# EAGLE design IMU_breakout (EAGLE 7.3.0)
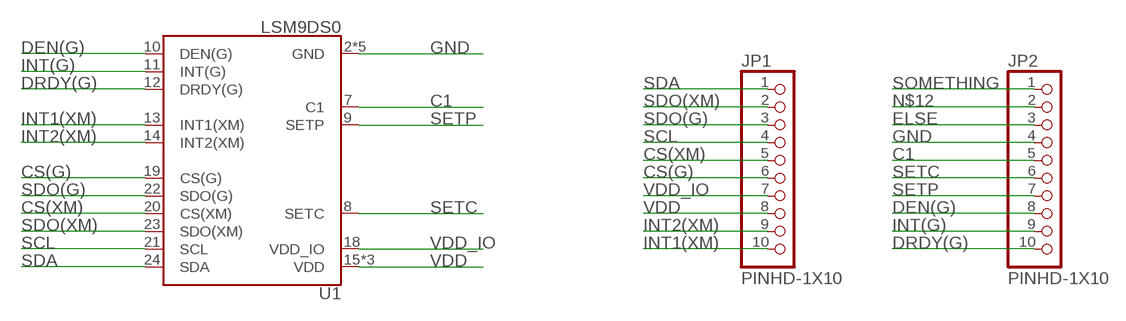
[diagram p0: schematic, sheet 1]

## Parts
JP1  PINHD-1X10  [1X10-BIG]
JP2  PINHD-1X10  [1X10-BIG]
U1  LSM9DS0  [LGA-24]

## Nets
C1: JP2.5 U1.7(C1)
CS(G): JP1.6 U1.19(CS(G))
CS(XM): JP1.5 U1.20(CS(XM))
DEN(G): JP2.8 U1.10(DEN(G))
DRDY(G): JP2.10 U1.12(DRDY(G))
ELSE: JP2.3
GND: JP2.4 U1.2(GND) U1.3(GND) U1.4(GND) U1.5(GND) U1.6(GND)
INT1(XM): JP1.10 U1.13(INT1(XM))
INT2(XM): JP1.9 U1.14(INT2(XM))
INT(G): JP2.9 U1.11(INT(G))
N$12: JP2.2
SCL: JP1.4 U1.21(SCL)
SDA: JP1.1 U1.24(SDA)
SDO(G): JP1.3 U1.22(SDO(G))
SDO(XM): JP1.2 U1.23(SDO(XM))
SETC: JP2.6 U1.8(SETC)
SETP: JP2.7 U1.9(SETP)
SOMETHING: JP2.1
VDD: JP1.8 U1.15(VDD) U1.16(VDD) U1.17(VDD)
VDD_IO: JP1.7 U1.18(VDD_IO)

## Library data of the parts
JP1 JP2 = adafruit:PINHD-1X10: Pin header 1x10 0.1" spacing With round pins
U1 = SparkFun-DigitalIC:LSM9DS0: LSM9DS0 3D Accelerometer, 3D Gyroscope, 3D Magnetomter Features: 3 acceleration channels, 3 angular rate channels, 3 magnetic field channels ±2/±4/±6/±8/±16 g linear acceleration full scale ±2/±4/±8/±12 gauss magnetic full scale ±245/±500/±2000 dps angular rate full scale 16-bit data output SPI / I2C serial interfaces Analog supply voltage 2.4 V to 3.6 V Power-down mode / low-power mode Programmable interrupt generators Embedded self-test Embedded temperature sensor Embedded FIFO Position and motion detection functions Click/double-click recognition

## Board
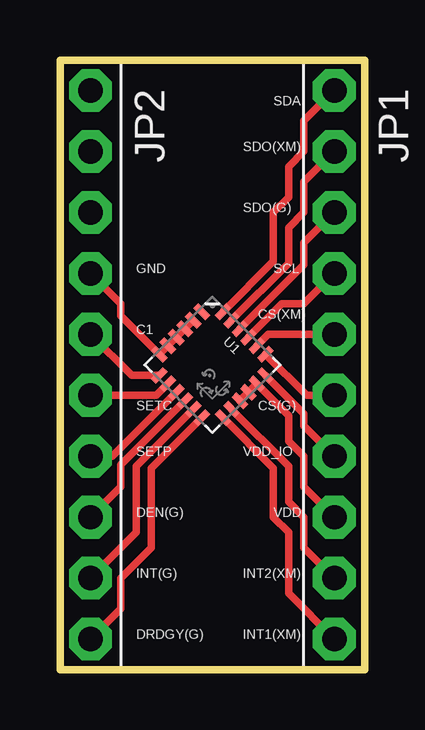
[diagram p1: board, top side]

Size 12.7 x 25.4 mm. Coordinates in mm from the lower left corner, seen from the top.
Outline: 0,0 0,25.4 12.7,25.4 12.7,0 0,0
Copper layers (1*16): Top 0.035mm / dielectric 1.5mm / Bottom 0.035mm
Design rules "default": minimum track width 10mil, minimum drill 24mil, track to track 8mil, track to pad 8mil, pad to pad 8mil, via to via 8mil, smd to smd 8mil, copper to edge 40mil, drill to drill 8mil, minimum pad ring 10mil, minimum via ring 8mil, stop-mask expansion 4mil, vias tented up to drill 0mil, thermal gap 10mil

### Footprints (pad centres in the part's own frame; a part is rotated, then mirrored left to right if it is on the bottom)
1X10-BIG = drill 1.016 pad 1.778 octagon: 1 -11.43,0; 2 -8.89,0; 3 -6.35,0; 4 -3.81,0; 5 -1.27,0; 6 1.27,0; 7 3.81,0; 8 6.35,0; 9 8.89,0; 10 11.43,0
LGA-24 = smd 0.7 x 0.29: 1 -1.875,1.25; 2 -1.875,0.75; 3 -1.875,0.25; 4 -1.875,-0.25; 5 -1.875,-0.75; 6 -1.875,-1.25; 13 1.875,-1.25; 14 1.875,-0.75; 15 1.875,-0.25; 16 1.875,0.25; 17 1.875,0.75; 18 1.875,1.25 | smd 0.29 x 0.7: 7 -1.25,-1.875; 8 -0.75,-1.875; 9 -0.25,-1.875; 10 0.25,-1.875; 11 0.75,-1.875; 12 1.25,-1.875; 19 1.25,1.875; 20 0.75,1.875; 21 0.25,1.875; 22 -0.25,1.875; 23 -0.75,1.875; 24 -1.25,1.875

### Placement (x,y rotation side)
JP1  11.43,12.7 270 top
JP2  1.27,12.7 270 top
U1  6.35,12.7 315 top

### Tracks (layer width: path | path; a pad name or v marks a point on that pad's centre or on a via)
C1
  Top 0.305: U1.7 2.98,12.26 JP2.5
CS(G)
  Top 0.305: U1.19 10.27,11.43 JP1.6
CS(XM)
  Top 0.305: U1.20 8.68,13.97 JP1.5
DEN(G)
  Top 0.305: U1.10 2.54,8.54 2.54,7.62 JP2.8
DRDY(G)
  Top 0.305: U1.12 3.81,8.39 3.81,5.08 2.54,3.81 2.54,2.54 JP2.10
GND
  Top 0.305: JP2.4 2.54,15.24 2.54,14.74 U1.6 U1.5 U1.4 U1.3 U1.2
INT1(XM)
  Top 0.305: U1.13 8.89,8.39 8.89,6.35 9.53,5.71 9.53,3.17 JP1.10
INT2(XM)
  Top 0.305: U1.14 9.53,8.46 9.53,6.99 10.16,6.35 10.16,5.08 JP1.9
INT(G)
  Top 0.305: U1.11 3.17,8.46 3.17,5.71 JP2.9
SCL
  Top 0.305: U1.21 9.24,15.24 10.16,15.24 JP1.4
SDA
  Top 0.305: U1.24 8.89,17.01 8.89,19.05 9.53,19.68 9.53,20.95 10.16,21.59 10.16,22.86 JP1.1
SDO(G)
  Top 0.305: U1.22 10.16,16.86 10.16,17.78 JP1.3
SDO(XM)
  Top 0.305: U1.23 9.53,16.94 9.53,18.41 10.16,19.05 10.16,20.32 JP1.2
SETC
  Top 0.305: U1.8 4.02,11.43 JP2.6
SETP
  Top 0.305: U1.9 2.19,8.89 JP2.7
VDD
  Top 0.305: JP1.8 10.16,7.62 10.16,8.89 9.53,9.53 9.53,10.59 U1.17 U1.16 U1.15
VDD_IO
  Top 0.305: U1.18 10.16,10.66 10.16,10.16 JP1.7

### Text on the board
tPlace: SDA | SDO(XM) | SDO(G) | GND | SCL | CS(XM) | C1 | SETC | CS(G) | SETP | VDD_IO | DEN(G) | VDD | INT(G) | INT2(XM) | DRDGY(G) | INT1(XM)